# Altium schematic sheet [04] - VIDEO INPUT.SchDoc
size A2; DocumentNumber: 4; SheetNumber: 4; SheetTotal: 18
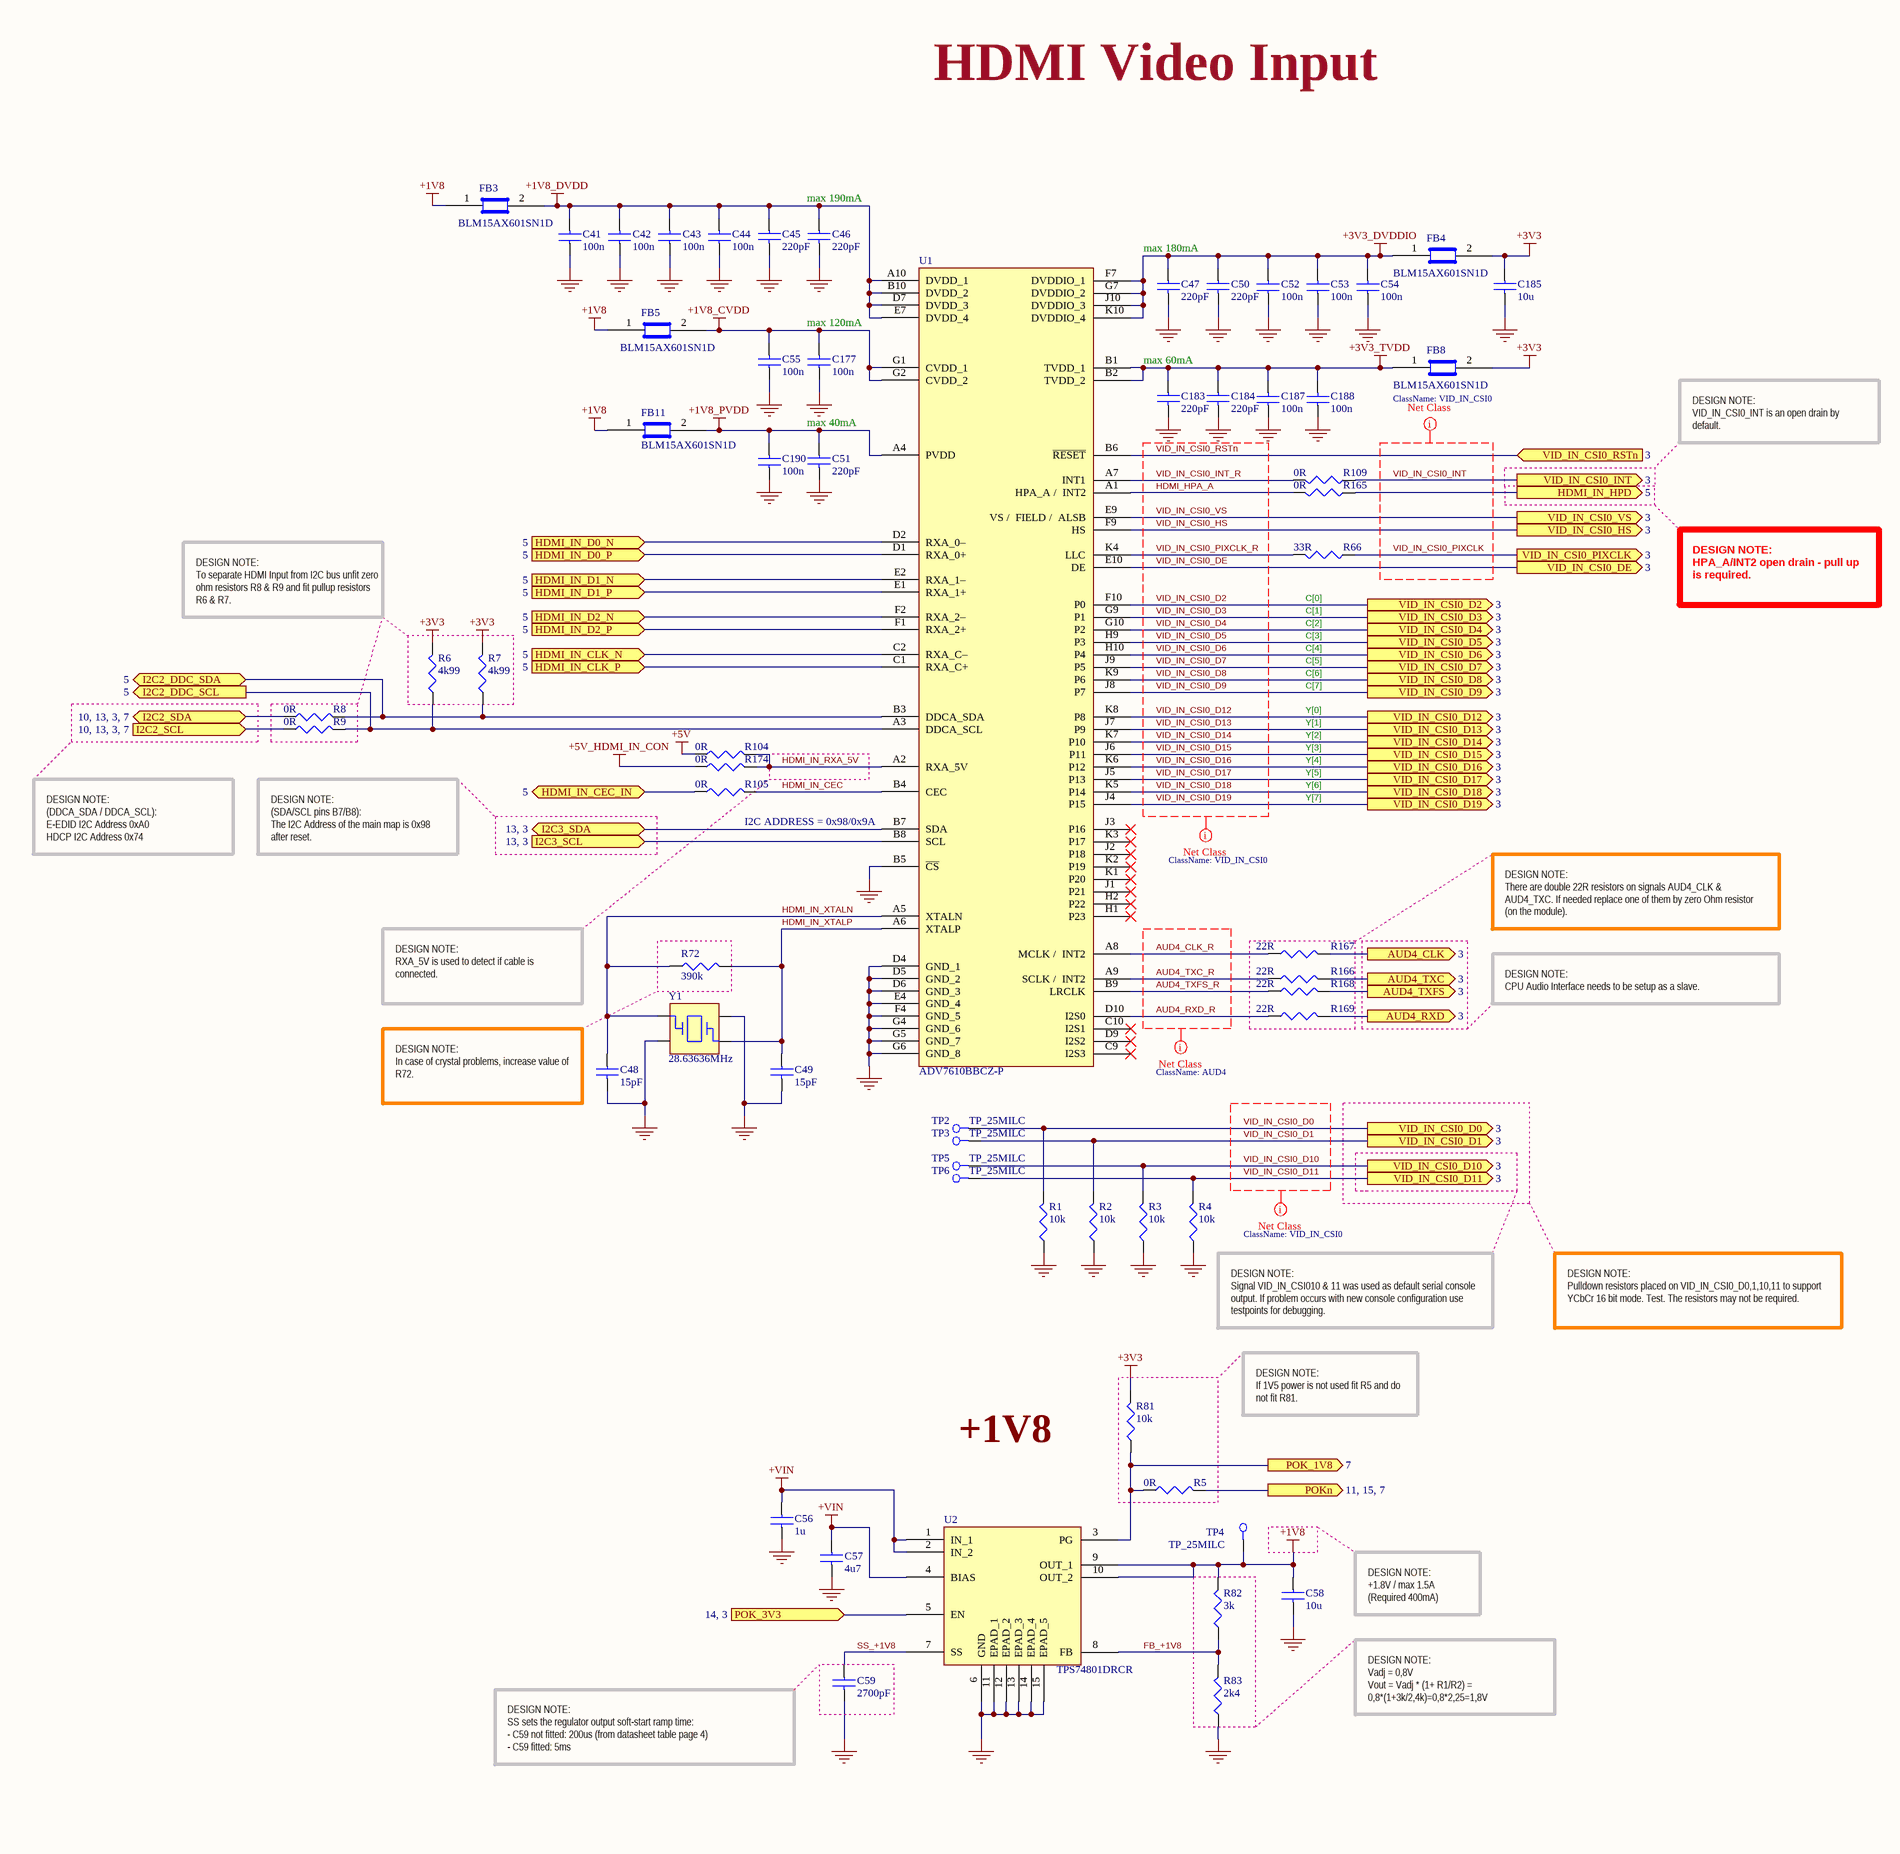
[diagram p0: [04] - VIDEO INPUT.SchDoc, left]
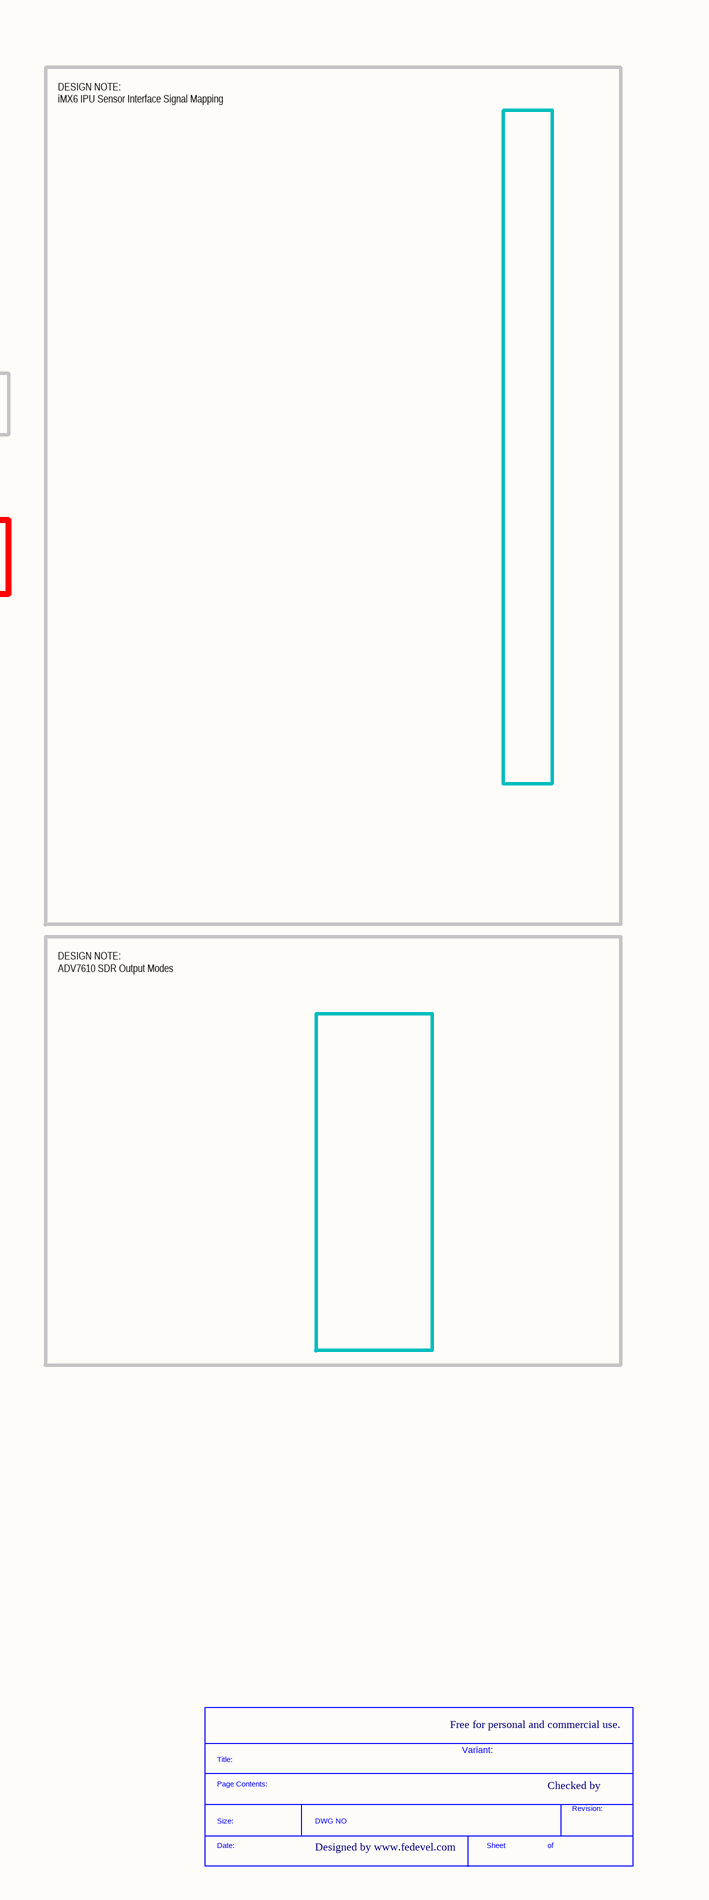
[diagram p1: [04] - VIDEO INPUT.SchDoc, right]

## Parts
*  SDTitleBlock  (value not drawn)  (graphical)
C41  100n  [C0402]
C42  100n  [C0402]
C43  100n  [C0402]
C44  100n  [C0402]
C45  220pF  [C0402]
C46  220pF  [C0402]
C47  220pF  [C0402]
C48  15pF  [C0402]
C49  15pF  [C0402]
C50  220pF  [C0402]
C51  220pF  [C0402]
C52  100n  [C0402]
C53  100n  [C0402]
C54  100n  [C0402]
C55  100n  [C0402]
C56  1u  [C0402]
C57  4u7  [C0402]
C58  10u  [C0603]
C59  2700pF  [C0402]
C177  100n  [C0402]
C183  220pF  [C0402]
C184  220pF  [C0402]
C185  10u  [C0603]
C187  100n  [C0402]
C188  100n  [C0402]
C190  100n  [C0402]
FB3  BLM15AX601SN1D  [C0402]
FB4  BLM15AX601SN1D  [C0402]
FB5  BLM15AX601SN1D  [C0402]
FB8  BLM15AX601SN1D  [C0402]
FB11  BLM15AX601SN1D  [C0402]
R1  10k  [R0402]
R2  10k  [R0402]
R3  10k  [R0402]
R4  10k  [R0402]
R5  0R  [R0402]
R6  4k99  [R0402]
R7  4k99  [R0402]
R8  0R  [R0402]
R9  0R  [R0402]
R66  33R  [R0402]
R72  390k  [R0402]
R81  10k  [R0402]
R82  3k  [R0402]
R83  2k4  [R0402]
R104  0R  [R0402]
R105  0R  [R0402]
R109  0R  [R0402]
R165  0R  [R0402]
R166  22R  [R0402]
R167  22R  [R0402]
R168  22R  [R0402]
R169  22R  [R0402]
R174  0R  [R0402]
TP2  TP_25MILC  [TP_25C]  (no BOM)
TP3  TP_25MILC  [TP_25C]  (no BOM)
TP4  TP_25MILC  [TP_25C]  (no BOM)
TP5  TP_25MILC  [TP_25C]  (no BOM)
TP6  TP_25MILC  [TP_25C]  (no BOM)
U1  ADV7610BBCZ-P  [76_CSP_BGA]
U2  TPS74801DRCR  [DRC (S-PVSON-N10)]
Y1  28.63636MHz  [ABM3B]

## Ports
AUD4_CLK (out, see 3), AUD4_RXD (out, see 3), AUD4_TXC (out, see 3), AUD4_TXFS (out, see 3), HDMI_IN_CEC_IN (bidir, see 5), HDMI_IN_CLK_N (in, see 5), HDMI_IN_CLK_P (in, see 5), HDMI_IN_D0_N (in, see 5), HDMI_IN_D0_P (in, see 5), HDMI_IN_D1_N (in, see 5), HDMI_IN_D1_P (in, see 5), HDMI_IN_D2_N (in, see 5), HDMI_IN_D2_P (in, see 5), HDMI_IN_HPD (out, see 5), I2C2_DDC_SCL (out, see 5), I2C2_DDC_SDA (bidir, see 5), I2C2_SCL (see 10, 13, 3, 7), I2C2_SDA (bidir, see 10, 13, 3, 7), I2C3_SCL (see 13, 3), I2C3_SDA (bidir, see 13, 3), POK_1V8 (out, see 7), POK_3V3 (see 14, 3), POKn (see 11, 15, 7), VID_IN_CSI0_D0 (out, see 3), VID_IN_CSI0_D1 (out, see 3), VID_IN_CSI0_D2 (out, see 3), VID_IN_CSI0_D3 (out, see 3), VID_IN_CSI0_D4 (out, see 3), VID_IN_CSI0_D5 (out, see 3), VID_IN_CSI0_D6 (out, see 3), VID_IN_CSI0_D7 (out, see 3), VID_IN_CSI0_D8 (out, see 3), VID_IN_CSI0_D9 (out, see 3), VID_IN_CSI0_D10 (out, see 3), VID_IN_CSI0_D11 (out, see 3), VID_IN_CSI0_D12 (out, see 3), VID_IN_CSI0_D13 (out, see 3), VID_IN_CSI0_D14 (out, see 3), VID_IN_CSI0_D15 (out, see 3), VID_IN_CSI0_D16 (out, see 3), VID_IN_CSI0_D17 (out, see 3), VID_IN_CSI0_D18 (out, see 3), VID_IN_CSI0_D19 (out, see 3), VID_IN_CSI0_DE (out, see 3), VID_IN_CSI0_HS (out, see 3), VID_IN_CSI0_INT (out, see 3), VID_IN_CSI0_PIXCLK (out, see 3), VID_IN_CSI0_RSTn (in, see 3), VID_IN_CSI0_VS (out, see 3)

## Nets
+1V8: C58.1 FB3.1 FB5.1 FB11.1 R82.2 TP4.1 U2.9(OUT_1) U2.10(OUT_2)
+1V8_CVDD: C55.2 C177.2 FB5.2 U1.G1(CVDD_1) U1.G2(CVDD_2)
+1V8_DVDD: C41.2 C42.2 C43.2 C44.2 C45.1 C46.1 FB3.2 U1.A10(DVDD_1) U1.B10(DVDD_2) U1.D7(DVDD_3) U1.E7(DVDD_4)
+1V8_PVDD: C51.1 C190.2 FB11.2 U1.A4(PVDD)
+3V3: C185.1 FB4.2 FB8.2 R6.2 R7.2 R81.2
+3V3_DVDDIO: C47.1 C50.1 C52.2 C53.2 C54.2 FB4.1 U1.F7(DVDDIO_1) U1.G7(DVDDIO_2) U1.J10(DVDDIO_3) U1.K10(DVDDIO_4)
+3V3_TVDD: C183.1 C184.1 C187.2 C188.2 FB8.1 U1.B1(TVDD_1) U1.B2(TVDD_2)
+5V: R104.1
+5V_HDMI_IN_CON: R174.1
+VIN: C56.1 C57.1 U2.1(IN_1) U2.2(IN_2) U2.4(BIAS)
GND: C41.1 C42.1 C43.1 C44.1 C45.2 C46.2 C47.2 C48.2 C49.2 C50.2 C51.2 C52.1 C53.1 C54.1 C55.1 C56.2 C57.2 C58.2 C59.2 C177.1 C183.2 C184.2 C185.2 C187.1 C188.1 C190.1 R1.1 R2.1 R3.1 R4.1 R83.1 U1.B5(~{CS}) U1.D4(GND_1) U1.D5(GND_2) U1.D6(GND_3) U1.E4(GND_4) U1.F4(GND_5) U1.G4(GND_6) U1.G5(GND_7) U1.G6(GND_8) U2.6(GND) U2.11(EPAD_1) U2.12(EPAD_2) U2.13(EPAD_3) U2.14(EPAD_4) U2.15(EPAD_5) Y1.2 Y1.4
AUD4_CLK: R167.2 ; port AUD4_CLK
AUD4_CLK_R: R167.1 U1.A8(MCLK_/__INT2)
AUD4_RXD: R169.2 ; port AUD4_RXD
AUD4_RXD_R: R169.1 U1.D10(I2S0)
AUD4_TXC: R166.2 ; port AUD4_TXC
AUD4_TXC_R: R166.1 U1.A9(SCLK_/__INT2)
AUD4_TXFS: R168.2 ; port AUD4_TXFS
AUD4_TXFS_R: R168.1 U1.B9(LRCLK)
FB_+1V8: R82.1 R83.2 U2.8(FB)
HDMI_HPA_A: R165.2 U1.A1(HPA_A_/__INT2)
HDMI_IN_CEC: R105.2 U1.B4(CEC)
HDMI_IN_CEC_IN: R105.1 ; port HDMI_IN_CEC_IN
HDMI_IN_CLK_N: U1.C2(RXA_C–) ; port HDMI_IN_CLK_N
HDMI_IN_CLK_P: U1.C1(RXA_C+) ; port HDMI_IN_CLK_P
HDMI_IN_D0_N: U1.D2(RXA_0–) ; port HDMI_IN_D0_N
HDMI_IN_D0_P: U1.D1(RXA_0+) ; port HDMI_IN_D0_P
HDMI_IN_D1_N: U1.E2(RXA_1–) ; port HDMI_IN_D1_N
HDMI_IN_D1_P: U1.E1(RXA_1+) ; port HDMI_IN_D1_P
HDMI_IN_D2_N: U1.F2(RXA_2–) ; port HDMI_IN_D2_N
HDMI_IN_D2_P: U1.F1(RXA_2+) ; port HDMI_IN_D2_P
HDMI_IN_HPD: R165.1 ; port HDMI_IN_HPD
HDMI_IN_RXA_5V: R104.2 R174.2 U1.A2(RXA_5V)
HDMI_IN_XTALN: C48.1 R72.1 U1.A5(XTALN) Y1.1
HDMI_IN_XTALP: C49.1 R72.2 U1.A6(XTALP) Y1.3
I2C2_DDC_SCL: R6.1 R9.2 U1.A3(DDCA_SCL) ; port I2C2_DDC_SCL
I2C2_DDC_SDA: R7.1 R8.2 U1.B3(DDCA_SDA) ; port I2C2_DDC_SDA
I2C2_SCL: R9.1 ; port I2C2_SCL
I2C2_SDA: R8.1 ; port I2C2_SDA
I2C3_SCL: U1.B8(SCL) ; port I2C3_SCL
I2C3_SDA: U1.B7(SDA) ; port I2C3_SDA
POK_1V8: R5.1 R81.1 U2.3(PG) ; port POK_1V8
POK_3V3: U2.5(EN) ; port POK_3V3
POKn: R5.2 ; port POKn
SS_+1V8: C59.1 U2.7(SS)
VID_IN_CSI0_D0: R1.2 TP2.1 ; port VID_IN_CSI0_D0
VID_IN_CSI0_D1: R2.2 TP3.1 ; port VID_IN_CSI0_D1
VID_IN_CSI0_D2: U1.F10(P0) ; port VID_IN_CSI0_D2
VID_IN_CSI0_D3: U1.G9(P1) ; port VID_IN_CSI0_D3
VID_IN_CSI0_D4: U1.G10(P2) ; port VID_IN_CSI0_D4
VID_IN_CSI0_D5: U1.H9(P3) ; port VID_IN_CSI0_D5
VID_IN_CSI0_D6: U1.H10(P4) ; port VID_IN_CSI0_D6
VID_IN_CSI0_D7: U1.J9(P5) ; port VID_IN_CSI0_D7
VID_IN_CSI0_D8: U1.K9(P6) ; port VID_IN_CSI0_D8
VID_IN_CSI0_D9: U1.J8(P7) ; port VID_IN_CSI0_D9
VID_IN_CSI0_D10: R3.2 TP5.1 ; port VID_IN_CSI0_D10
VID_IN_CSI0_D11: R4.2 TP6.1 ; port VID_IN_CSI0_D11
VID_IN_CSI0_D12: U1.K8(P8) ; port VID_IN_CSI0_D12
VID_IN_CSI0_D13: U1.J7(P9) ; port VID_IN_CSI0_D13
VID_IN_CSI0_D14: U1.K7(P10) ; port VID_IN_CSI0_D14
VID_IN_CSI0_D15: U1.J6(P11) ; port VID_IN_CSI0_D15
VID_IN_CSI0_D16: U1.K6(P12) ; port VID_IN_CSI0_D16
VID_IN_CSI0_D17: U1.J5(P13) ; port VID_IN_CSI0_D17
VID_IN_CSI0_D18: U1.K5(P14) ; port VID_IN_CSI0_D18
VID_IN_CSI0_D19: U1.J4(P15) ; port VID_IN_CSI0_D19
VID_IN_CSI0_DE: U1.E10(DE) ; port VID_IN_CSI0_DE
VID_IN_CSI0_HS: U1.F9(HS) ; port VID_IN_CSI0_HS
VID_IN_CSI0_INT: R109.1 ; port VID_IN_CSI0_INT
VID_IN_CSI0_INT_R: R109.2 U1.A7(INT1)
VID_IN_CSI0_PIXCLK: R66.1 ; port VID_IN_CSI0_PIXCLK
VID_IN_CSI0_PIXCLK_R: R66.2 U1.K4(LLC)
VID_IN_CSI0_RSTn: U1.B6(~{RESET}) ; port VID_IN_CSI0_RSTn
VID_IN_CSI0_VS: U1.E9(VS_/__FIELD_/__ALSB) ; port VID_IN_CSI0_VS

Not connected (* = marked no-connect by the designer): U1 C9(I2S3)* C10(I2S1)* D9(I2S2)* H1(P23)* H2(P22)* J1(P21)* J2(P18)* J3(P16)* K1(P20)* K2(P19)* K3(P17)*

## Layout directives
net class VID_IN_CSI0: HDMI_HPA_A, VID_IN_CSI0_D0, VID_IN_CSI0_D1, VID_IN_CSI0_D2, VID_IN_CSI0_D3, VID_IN_CSI0_D4, VID_IN_CSI0_D5, VID_IN_CSI0_D6, VID_IN_CSI0_D7, VID_IN_CSI0_D8, VID_IN_CSI0_D9, VID_IN_CSI0_D10, VID_IN_CSI0_D11, VID_IN_CSI0_D12, VID_IN_CSI0_D13, VID_IN_CSI0_D14, VID_IN_CSI0_D15, VID_IN_CSI0_D16, VID_IN_CSI0_D17, VID_IN_CSI0_D18, VID_IN_CSI0_D19, VID_IN_CSI0_DE, VID_IN_CSI0_HS, VID_IN_CSI0_INT, VID_IN_CSI0_INT_R, VID_IN_CSI0_PIXCLK, VID_IN_CSI0_PIXCLK_R, VID_IN_CSI0_RSTn, VID_IN_CSI0_VS
net class AUD4: AUD4_CLK_R, AUD4_RXD_R, AUD4_TXC_R, AUD4_TXFS_R

## Notes on the sheet
- HDMI Video Input
- DESIGN NOTE:
  iMX6 IPU Sensor Interface Signal Mapping
- (near C46) max 190mA
- max 180mA
- (near C177) max 120mA
- max 60mA
- (near C51) max 40mA
- DESIGN NOTE:
  VID_IN_CSI0_INT is an open drain by default.
- DESIGN NOTE:
  HPA_A/INT2 open drain - pull up is required.
- DESIGN NOTE:
  To separate HDMI Input from I2C bus unfit zero ohm resistors R8 & R9 and fit pullup resistors R6 & R7.
- (near R66) C[0]
- C[1]
- C[2]
- C[3]
- C[4]
- C[5]
- C[6]
- C[7]
- Y[0]
- Y[1]
- Y[2]
- Y[3]
- Y[4]
- Y[5]
- (near R105) I2C ADDRESS = 0x98/0x9A
- Y[6]
- Y[7]
- DESIGN NOTE:
  (DDCA_SDA / DDCA_SCL):
  E-EDID I2C Address 0xA0
  HDCP I2C Address 0x74
- DESIGN NOTE:
  (SDA/SCL pins B7/B8):
  The I2C Address of the main map is 0x98 after reset.
- DESIGN NOTE:
  There are double 22R resistors on signals AUD4_CLK & AUD4_TXC. If needed replace one of them by zero Ohm resistor (on the module).
- DESIGN NOTE:
  RXA_5V is used to detect if cable is connected.
- DESIGN NOTE:
  CPU Audio Interface needs to be setup as a slave.
- DESIGN NOTE:
  ADV7610 SDR Output Modes
- (near C48) DESIGN NOTE:
  In case of crystal problems, increase value of R72.
- (near R4) DESIGN NOTE:
  Signal VID_IN_CSI010 & 11 was used as default serial console output. If problem occurs with new console configuration use testpoints for debugging.
- DESIGN NOTE:
  Pulldown resistors placed on VID_IN_CSI0_D0,1,10,11 to support YCbCr 16 bit mode. Test. The resistors may not be required.
- +1V8
- DESIGN NOTE:
  If 1V5 power is not used fit R5 and do not fit R81.
- DESIGN NOTE:
  +1.8V / max 1.5A
  (Required 400mA)
- DESIGN NOTE:
  Vadj = 0,8V
  Vout = Vadj * (1+ R1/R2) = 0,8*(1+3k/2,4k)=0,8*2,25=1,8V
- DESIGN NOTE:
  SS sets the regulator output soft-start ramp time:
  - C59 not fitted: 200us (from datasheet table page 4)
  - C59 fitted: 5ms
- Free for personal and commercial use.
- Variant:
- Checked by
- Designed by www.fedevel.com
- (in symbol SDTitleBlock) Title:; Page Contents:; Revision:; Size:; DWG NO; Date:; Sheet; of

## Library data of the parts
C41-C44 C52-C55 C177 C187 C188 C190 = C1005X5R1H104K: CAP CER .10UF 50V X5R 10% 0402; Manufacturer: TDK Corporation; Capacitance: 0.1µF; Value: 100nF; .Checked PCB: used; Category: Capacitors; Supplier Part Number: 445-5942-1-ND; Manufacturer Part Number: C1005X5R1H104K; Operating Temperature: -55°C ~ 85°C; Package / Case: 0402 (1005 Metric); Price 1k [$]: 0.02340; .Checked SCH: used; Voltage - Rated: 50V; Supplier: Digikey; Supplier 1: Digi-Key; Supplier Part Number 1: 445-5942-1-ND; RoHS: RoHS Compliant; Stock 1: 106926; Pricing 1: 1=0.27, 10=0.18, 100=0.072, 250=0.05176, 500=0.0369, 1000=0.027 (USD); Tolerance: ±10%; Temperature Coefficient: X5R; Mounting Type: Surface Mount, MLCC; Applications: General Purpose; Ratings: -; Size / Dimension: 0.039" L x 0.020" W (1.00mm x 0.50mm); Height - Seated (Max): -; Thickness (Max): 0.022" (0.55mm); Lead Spacing: -; Features: -; Packaging: Cut Tape (CT); Lead Style: -; ComponentLink1URL: http://www.tdk.co.jp/tefe02/e412_c.pdf; ComponentLink1Description: http://www.tdk.co.jp/tefe02/e412_c.pdf
C45-C47 C50 C51 C183 C184 = C1005X7R1H221K: CAP CER 220PF 50V X7R 10% 0402; Manufacturer: TDK Corporation; .Checked PCB: used; Capacitance: 220pF; Category: Capacitors; Supplier Part Number: 445-1254-1-ND; Manufacturer Part Number: C1005X7R1H221K; Operating Temperature: -55°C ~ 125°C; Package / Case: 0402 (1005 Metric); Price 1k [$]: 0.00650; Value: 220pF; .Checked SCH: used; Voltage - Rated: 50V; Supplier: Digikey; Supplier 1: Digi-Key; Supplier Part Number 1: 445-1254-1-ND; RoHS: RoHS Compliant; Stock 1: 212041; Pricing 1: 1=0.08, 10=0.05, 100=0.018, 250=0.013, 500=0.0096, 1000=0.0065 (USD); Tolerance: ±10%; Temperature Coefficient: X7R; Mounting Type: Surface Mount, MLCC; Applications: General Purpose; Ratings: -; Size / Dimension: 0.039" L x 0.020" W (1.00mm x 0.50mm); Height - Seated (Max): -; Thickness (Max): 0.022" (0.55mm); Lead Spacing: -; Features: -; Packaging: Cut Tape (CT); Lead Style: -; ComponentLink1URL: http://www.tdk.co.jp/tefe02/e412_c.pdf; ComponentLink1Description: http://www.tdk.co.jp/tefe02/e412_c.pdf
C48 C49 = C1005C0G1H150J: CAP CER 15PF 50V 5% NP0 0402; Manufacturer: TDK Corporation; Temperature Coefficient: C0G, NP0; .Checked PCB: used; Supplier 1: Digi-Key; Supplier Part Number 1: 445-1237-1-ND; Manufacturer Part Number: C1005C0G1H150J; RoHS: RoHS Compliant; Category: Capacitors; Stock 1: 204632; Pricing 1: 10=0.024, 100=0.011, 250=0.009, 500=0.0077, 1000=0.006, 5000=0.005 (USD); Capacitance: 15pF; Voltage - Rated: 50V; Tolerance: ±5%; Mounting Type: Surface Mount, MLCC; Operating Temperature: -55°C ~ 125°C; Applications: General Purpose; Ratings: -; Package / Case: 0402 (1005 Metric); Size / Dimension: 0.039" L x 0.020" W (1.00mm x 0.50mm); Height - Seated (Max): -; Thickness (Max): 0.022" (0.55mm); Lead Spacing: -; Features: -; Packaging: Cut Tape (CT); Lead Style: -; ComponentLink1URL: http://www.tdk.com/pdf/general_B11.pdf; ComponentLink1Description: http://www.tdk.com/pdf/general_B11.pdf; .Checked SCH: used
C56 = C1005X5R1C105K: CAP CER 1.0UF 16V X5R 0402; Manufacturer: TDK Corporation; Capacitance: 1.0µF; Value: 1uF; .Checked PCB: used; Tolerance: ±10%; Category: Capacitors; Supplier Part Number: 445-4978-1-ND; Manufacturer Part Number: C1005X5R1C105K; Operating Temperature: -55°C ~ 85°C; Package / Case: 0402 (1005 Metric); Price 1k [$]: 0.02080; .Checked SCH: used; Voltage - Rated: 16V; Supplier: Digikey; Supplier 1: Digi-Key; Supplier Part Number 1: 445-4978-1-ND; RoHS: RoHS Compliant; Stock 1: 341010; Pricing 1: 1=0.24, 10=0.16, 100=0.064, 250=0.046, 500=0.0328, 1000=0.024 (USD); Temperature Coefficient: X5R; Mounting Type: Surface Mount, MLCC; Applications: General Purpose; Ratings: -; Size / Dimension: 0.039" L x 0.020" W (1.00mm x 0.50mm); Height - Seated (Max): -; Thickness (Max): 0.022" (0.55mm); Lead Spacing: -; Features: -; Packaging: Cut Tape (CT); Lead Style: -; ComponentLink1URL: http://www.tdk.co.jp/tefe02/e412_c.pdf; ComponentLink1Description: http://www.tdk.co.jp/tefe02/e412_c.pdf
C57 = C1005X5R1A475M: CAP CER 4.7UF 10V 20% X5R 0402; Manufacturer: TDK Corporation; Capacitance: 4.7µF; .Checked PCB: used; Supplier 1: Digi-Key; Supplier Part Number 1: 445-8023-1-ND; Manufacturer Part Number: C1005X5R1A475M; RoHS: RoHS Compliant; Category: Capacitors; Stock 1: 10140; Pricing 1: 1=0.53, 10=0.415, 100=0.25, 250=0.18752, 500=0.16, 1000=0.125, 5000=0.095 (USD); Voltage - Rated: 10V; Tolerance: ±20%; Temperature Coefficient: X5R; Mounting Type: Surface Mount, MLCC; Operating Temperature: -55°C ~ 85°C; Applications: General Purpose; Ratings: -; Package / Case: 0402 (1005 Metric); Size / Dimension: 0.039" L x 0.020" W (1.00mm x 0.50mm); Height - Seated (Max): -; Thickness (Max): -; Lead Spacing: -; Features: -; Packaging: Cut Tape (CT); Lead Style: -; ComponentLink1URL: http://www.tdk.com/pdf/general_B11.pdf; ComponentLink1Description: http://www.tdk.com/pdf/general_B11.pdf; .Checked SCH: used
C58 C185 = C1608X5R0J106M: CAP CER 10UF 6.3V X5R 20% 0603; Manufacturer: TDK Corporation; Capacitance: 10µF; Value: 10µF; .Checked PCB: used; Category: Capacitors; Supplier Part Number: 445-4112-1-ND; Manufacturer Part Number: C1608X5R0J106M; Operating Temperature: -55°C ~ 85°C; Package / Case: 0603 (1608 Metric); Price 1k [$]: 0.08580; .Checked SCH: used; Voltage - Rated: 6.3V; Features: Low ESR; Supplier: Digikey; Supplier 1: Digi-Key; Supplier Part Number 1: 445-4112-1-ND; RoHS: RoHS Compliant; Stock 1: 48157; Pricing 1: 1=0.46, 10=0.363, 100=0.1898, 250=0.14024, 500=0.1089, 1000=0.0858 (USD); Tolerance: ±20%; Temperature Coefficient: X5R; Mounting Type: Surface Mount, MLCC; Applications: General Purpose; Ratings: -; Size / Dimension: 0.063" L x 0.031" W (1.60mm x 0.80mm); Height - Seated (Max): -; Thickness (Max): 0.037" (0.95mm); Lead Spacing: -; Packaging: Cut Tape (CT); Lead Style: -; ComponentLink1URL: http://www.tdk.com/pdf/general_B11.pdf; ComponentLink1Description: http://www.tdk.com/pdf/general_B11.pdf
C59 = GRM155R71H272KA01D: CAP CER 2700PF 50V 10% X7R 0402; Manufacturer: Murata Electronics North America; .Checked PCB: used; Supplier 1: Digi-Key; Supplier Part Number 1: 490-1306-1-ND; Manufacturer Part Number: GRM155R71H272KA01D; RoHS: RoHS Compliant; Category: Capacitors; Stock 1: 38160; Pricing 1: 10=0.01, 50=0.0086, 100=0.0074, 250=0.00664, 500=0.00618, 750=0.00571, 1000=0.00542 (USD); Capacitance: 2700pF; Voltage - Rated: 50V; Tolerance: ±10%; Temperature Coefficient: X7R; Mounting Type: Surface Mount, MLCC; Operating Temperature: -55°C ~ 125°C; Applications: General Purpose; Ratings: -; Package / Case: 0402 (1005 Metric); Size / Dimension: 0.039" L x 0.020" W (1.00mm x 0.50mm); Height - Seated (Max): -; Thickness (Max): 0.022" (0.55mm); Lead Spacing: -; Features: -; Packaging: Cut Tape (CT); Lead Style: -; ComponentLink1URL: http://search.murata.co.jp/Ceramy/image/img/PDF/ENG/GRM155R71H272KA01.pdf; ComponentLink1Description: http://search.murata.co.jp/Ceramy/image/img/PDF/ENG/GRM155R71H272KA01.pdf; .Checked SCH: used
FB3-FB5 FB8 FB11 = BLM15AX601SN1D: FERRITE CHIP 600 OHM 0402 420mA; Manufacturer: Murata Electronics North America; .Checked PCB: used; Impedance @ Frequency: 600 Ohm @ 100MHz; DC Resistance (DCR): 340 mOhm Max; Filter Type: Differential Mode - Single; Number of Lines: 1; .Checked SCH: used; Category: Filters; Supplier Part Number: 490-5441-1-ND; Manufacturer Part Number: BLM15AX601SN1D; Package / Case: 0402 (1005 Metric); Price 1k [$]: 0.03280; Value: BLM15AX601SN1D; Current Rating: 420mA; Supplier: Digikey; Supplier 1: Digi-Key; Supplier Part Number 1: 490-5441-1-ND; RoHS: RoHS Compliant; Stock 1: 34008; Pricing 1: 1=0.26, 10=0.197, 50=0.1148, 100=0.0918, 250=0.0656, 500=0.0446, 1000=0.03608, 5000=0.02821 (USD); Mounting Type: Surface Mount; Packaging: Cut Tape (CT); Height (Max): 0.022" (0.55mm); Size / Dimension: 0.039" L x 0.020" W (1.00mm x 0.50mm); ComponentLink1URL: http://search.murata.co.jp/Ceramy/image/img/PDF/ENG/L0110S0100BLM15AX_SN.pdf; ComponentLink1Description: http://search.murata.co.jp/Ceramy/image/img/PDF/ENG/L0110S0100BLM15AX_SN.pdf
R1-R4 R81 = RC0402FR-0710KL: RES 10.0K OHM 1/16W 1% 0402 SMD; Manufacturer: Yageo; Power (Watts): 0.063W, 1/16W; .Checked PCB: used; Temperature Coefficient: ±100ppm/°C; Category: Resistors; Manufacturer Part Number: RC0402FR-0710KL; Package / Case: 0402 (1005 Metric); Price 1k [$]: 0.01421; Resistance (Ohms): 10K; Tolerance: ±1%; Value: 10k; .Checked SCH: used; Supplier Part Number: 311-10.0KLRCT-ND; Supplier: Digikey; Supplier 1: Digi-Key; Supplier Part Number 1: 311-10.0KLRCT-ND; RoHS: RoHS Compliant; Stock 1: 2916495; Pricing 1: 10=0.014, 50=0.0104, 100=0.0079, 250=0.00584, 500=0.00432, 1000=0.00288 (USD); Composition: Thick Film; Features: -; Size / Dimension: 0.039" L x 0.020" W (1.00mm x 0.50mm); Height: 0.016" (0.40mm); Number of Terminations: 2; Packaging: Cut Tape (CT); ComponentLink1URL: http://www.yageo.com/documents/recent/PYu-RC0402_51_RoHS_L_6.pdf; ComponentLink1Description: http://www.yageo.com/documents/recent/PYu-RC0402_51_RoHS_L_6.pdf
R5 R8 R9 R104 R105 R109 R165 R174 = RC0402JR-070RL: RES 0.0 OHM 1/16W 0402 SMD; Manufacturer: Yageo; Resistance (Ohms): 0.0; Power (Watts): 0.063W, 1/16W; Tolerance: Jumper; .Checked PCB: used; Category: Resistors; Manufacturer Part Number: RC0402JR-070RL; Package / Case: 0402 (1005 Metric); Price 1k [$]: 0.01389; Value: 0R; .Checked SCH: used; Supplier Part Number: 311-0.0JRCT-ND; Supplier: Digikey; Supplier 1: Digi-Key; Supplier Part Number 1: 311-0.0JRCT-ND; RoHS: RoHS Compliant; Stock 1: 1106330; Pricing 1: 10=0.012, 50=0.009, 100=0.0069, 250=0.00512, 500=0.0038, 1000=0.00253 (USD); Composition: Thick Film; Features: -; Temperature Coefficient: -; Size / Dimension: 0.039" L x 0.020" W (1.00mm x 0.50mm); Height: 0.016" (0.40mm); Number of Terminations: 2; Packaging: Cut Tape (CT); ComponentLink1URL: http://www.yageo.com/documents/recent/PYu-RC0402_51_RoHS_L_6.pdf; ComponentLink1Description: http://www.yageo.com/documents/recent/PYu-RC0402_51_RoHS_L_6.pdf
R6 R7 = RMCF0402FT4K99: RES TF 4.99K OHM 1% 1/16W 0402; Manufacturer: Stackpole Electronics Inc; Power (Watts): 0.063W, 1/16W; .Checked PCB: used; Temperature Coefficient: ±100ppm/°C; Category: Resistors; Supplier Part Number: RMCF0402FT4K99CT-ND; Manufacturer Part Number: RMCF0402FT4K99; Package / Case: 0402 (1005 Metric); Price 1k [$]: 0.00384; Resistance (Ohms): 4.99K; Tolerance: ±1%; Value: 4k99; .Checked SCH: used; Supplier: Digikey; Supplier 1: Digi-Key; Supplier Part Number 1: RMCF0402FT4K99CT-ND; RoHS: RoHS Compliant; Stock 1: 48509; Pricing 1: 1=0.04, 10=0.025, 50=0.0138, 100=0.0105, 250=0.0078, 500=0.00576, 1000=0.00384 (USD); Composition: Thick Film; Features: -; Size / Dimension: 0.039" L x 0.020" W (1.00mm x 0.50mm); Height: 0.016" (0.40mm); Number of Terminations: 2; Packaging: Cut Tape (CT); ComponentLink1URL: http://www.seielect.com/Catalog/SEI-RMCF.pdf; ComponentLink1Description: http://www.seielect.com/Catalog/SEI-RMCF.pdf
R66 = RMCF0402FT33R0: RES TF 33 OHM 1% 1/16W 0402; Manufacturer: Stackpole Electronics Inc; Resistance (Ohms): 33; Power (Watts): 0.063W, 1/16W; .Checked PCB: used; Temperature Coefficient: ±100ppm/°C; Category: Resistors; Supplier Part Number: RMCF0402FT33R0CT-ND; Manufacturer Part Number: RMCF0402FT33R0; Package / Case: 0402 (1005 Metric); Price 1k [$]: 0.00384; Tolerance: ±1%; Value: 33R; .Checked SCH: used; Supplier: Digikey; Supplier 1: Digi-Key; Supplier Part Number 1: RMCF0402FT33R0CT-ND; RoHS: RoHS Compliant; Stock 1: 26866; Pricing 1: 1=0.04, 10=0.025, 50=0.0138, 100=0.0105, 250=0.0078, 500=0.00576, 1000=0.00384 (USD); Composition: Thick Film; Features: -; Size / Dimension: 0.039" L x 0.020" W (1.00mm x 0.50mm); Height: 0.016" (0.40mm); Number of Terminations: 2; Packaging: Cut Tape (CT); ComponentLink1URL: http://www.seielect.com/Catalog/SEI-RMCF.pdf; ComponentLink1Description: http://www.seielect.com/Catalog/SEI-RMCF.pdf
R72 = CRCW0402390KFKED: RES 390K OHM 1/16W 1% 0402 SMD; Manufacturer: Vishay Dale; Power (Watts): 0.063W, 1/16W; Temperature Coefficient: ±100ppm/°C; .Creator: MM; .Checked SCH: used; Supplier 1: Digi-Key; Manufacturer Part Number: CRCW0402390KFKED; RoHS: RoHS Compliant; Category: Resistors; Stock 1: 288225; Pricing 1: 10=0.083, 50=0.0444, 200=0.0255, 1000=0.0174 (USD); Packaging: Cut Tape (CT); Resistance (Ohms): 390k; Tolerance: ±1%; Composition: Thick Film; Features: Automotive AEC-Q200 Qualified; Package / Case: 0402 (1005 Metric); Supplier Device Package: 0402 (1005 Metric); Size / Dimension: 0.039" L x 0.020" W (1.00mm x 0.50mm); Height: 0.016" (0.40mm); Number of Terminations: 2; ComponentLink1URL: http://www.vishay.com/docs/20035/dcrcwe3.pdf; ComponentLink1Description: http://www.vishay.com/docs/20035/dcrcwe3.pdf; Supplier Part Number 1: 541-390KLCT-ND; .Checked PCB: used
R82 = RC0402FR-073KL: RES 3K OHM 1/16W 1% 0402 SMD; Manufacturer: Yageo; Power (Watts): 0.063W, 1/16W; Temperature Coefficient: ±100ppm/°C; .Creator: MM; .Checked SCH: used; Supplier 1: Digi-Key; Manufacturer Part Number: RC0402FR-073KL; RoHS: RoHS Compliant; Category: Resistors; Stock 1: 194271; Pricing 1: 1=0.1, 10=0.014, 25=0.0104, 100=0.0063, 250=0.0054, 500=0.00382, 1000=0.0027, 2500=0.00234, 5000=0.00203 (USD); Packaging: Cut Tape (CT); Resistance (Ohms): 3k; Tolerance: ±1%; Composition: Thick Film; Features: -; Package / Case: 0402 (1005 Metric); Supplier Device Package: 0402; Size / Dimension: 0.039" L x 0.020" W (1.00mm x 0.50mm); Height: 0.016" (0.40mm); Number of Terminations: 2; ComponentLink1URL: http://www.yageo.com/documents/recent/PYu-RC0402_51_RoHS_L_6.pdf; ComponentLink1Description: http://www.yageo.com/documents/recent/PYu-RC0402_51_RoHS_L_6.pdf; Supplier Part Number 1: 311-3KLRCT-ND; .Checked PCB: used
R83 = CRCW04022K40FKED: RES 2.40K OHM 1/16W 1% 0402 SMD; Manufacturer: Vishay Dale; Resistance (Ohms): 2.4K; Power (Watts): 0.063W, 1/16W; Temperature Coefficient: ±100ppm/°C; .Checked PCB: used; Supplier 1: Digi-Key; Supplier Part Number 1: 541-2.40KLCT-ND; Manufacturer Part Number: CRCW04022K40FKED; RoHS: RoHS Compliant; Category: Resistors; Stock 1: 43967; Pricing 1: 10=0.083, 50=0.0444, 200=0.0255, 1000=0.0174 (USD); Composition: Thick Film; Features: -; Tolerance: ±1%; Package / Case: 0402 (1005 Metric); Size / Dimension: 0.039" L x 0.020" W (1.00mm x 0.50mm); Height: 0.016" (0.40mm); Number of Terminations: 2; Packaging: Cut Tape (CT); ComponentLink1URL: http://www.vishay.com/doc?20035; ComponentLink1Description: http://www.vishay.com/doc?20035; .Checked SCH: used
R166-R169 = RC0402FR-0722RL: RES 22.0 OHM 1/16W 1% 0402 SMD; Manufacturer: Yageo; Resistance (Ohms): 22; Power (Watts): 0.063W, 1/16W; .Checked PCB: used; Temperature Coefficient: ±100ppm/°C; Category: Resistors; Supplier Part Number: 311-22.0LRCT-ND; Manufacturer Part Number: RC0402FR-0722RL; Package / Case: 0402 (1005 Metric); Price 1k [$]: 0.01421; Tolerance: ±1%; Value: 22R; .Checked SCH: used; Supplier: Digikey; Supplier 1: Digi-Key; Supplier Part Number 1: 311-22.0LRCT-ND; RoHS: RoHS Compliant; Stock 1: 943800; Pricing 1: 10=0.014, 50=0.0104, 100=0.0079, 250=0.00584, 500=0.00432, 1000=0.00288 (USD); Composition: Thick Film; Features: -; Size / Dimension: 0.039" L x 0.020" W (1.00mm x 0.50mm); Height: 0.016" (0.40mm); Number of Terminations: 2; Packaging: Cut Tape (CT); ComponentLink1URL: http://www.yageo.com/documents/recent/PYu-RC0402_51_RoHS_L_6.pdf; ComponentLink1Description: http://www.yageo.com/documents/recent/PYu-RC0402_51_RoHS_L_6.pdf
TP2-TP6 = TP_25MILC: Test Point 25mil
U1 = ADV7610BBCZ-P: IC RCVR HDMI 165MHZ LP 76-CSBGA; Manufacturer: Analog Devices Inc; .Creator: MM; .Checked PCB: used; Supplier 1: Digi-Key; Manufacturer Part Number: ADV7610BBCZ-P; RoHS: RoHS Compliant; Category: Integrated Circuits (ICs); Stock 1: 47; Pricing 1: 1=14.23, 10=12.938, 100=10.9974, 250=10.02704, 500=9.38012, 1000=8.60384, 2500=8.484 (USD); Packaging: Tray; Type: HDMI, Receiver; Applications: Digital Video; Mounting Type: Surface Mount; Package / Case: 76-LFBGA, CSPBGA; Supplier Device Package: 76-CSPBGA (6x6); ComponentLink1URL: http://www.analog.com/static/imported-files/data_sheets/ADV7610.pdf; ComponentLink1Description: http://www.analog.com/static/imported-files/data_sheets/ADV7610.pdf; Supplier Part Number 1: ADV7610BBCZ-P-ND; .Checked SCH: used
U2 = TPS74801DRCR: IC REG LDO ADJ 1.5A 10SON; Manufacturer: Texas Instruments; Number of Regulators: 1; Regulator Topology: Positive Adjustable; Voltage - Input: 0.8 V ~ 5.5 V; Voltage - Output: 0.8 V ~ 3.6 V; Voltage - Dropout (Typical): 0.06V @ 1.5A; Current - Output: 1.5A (Max); Current - Limit (Min): 2A; .Creator: MM; .Checked PCB: used; Supplier 1: Digi-Key; Manufacturer Part Number: TPS74801DRCR; RoHS: RoHS Compliant; Category: Integrated Circuits (ICs); Stock 1: 11680; Pricing 1: 1=2.3, 10=2.074, 25=1.8576, 100=0.972, 250=0.954, 500=0.936, 750=0.918 (USD); Packaging: Cut Tape (CT); Operating Temperature: -40°C ~ 125°C; Mounting Type: Surface Mount; Package / Case: 10-VFDFN Exposed Pad; Supplier Device Package: 10-SON (3x3); ComponentLink1URL: http://www.ti.com/lit/ds/symlink/tps74801.pdf; ComponentLink1Description: http://www.ti.com/lit/ds/symlink/tps74801.pdf; Supplier Part Number 1: 296-21563-1-ND; .Checked SCH: used
Y1 = ABM3B-28.63636MHZ-10-1-U-T: CRYSTAL 28.63636MHZ 10PF SMD; Manufacturer: Abracon Corporation; Frequency Stability: ±10ppm; ESR (Equivalent Series Resistance): 50 Ohm; Operating Mode: Fundamental; .Creator: MM; .Checked PCB: MM, paper model not checked; Supplier 1: Digi-Key; Manufacturer Part Number: ABM3B-28.63636MHZ-10-1-U-T; RoHS: RoHS Compliant; Category: Crystals and Oscillators; Stock 1: 889; Pricing 1: 1=1.09, 10=0.968, 50=0.904, 100=0.8, 500=0.756 (USD); Packaging: Cut Tape (CT); Type: MHz Crystal; Frequency: 28.63636MHz; Frequency Tolerance: ±10ppm; Load Capacitance: 10pF; Operating Temperature: -10°C ~ 60°C; Ratings: -; Mounting Type: Surface Mount; Package / Case: 4-SMD, No Lead (DFN, LCC); Size / Dimension: 0.197" L x 0.126" W (5.00mm x 3.20mm); Height: 0.043" (1.10mm); ComponentLink1URL: http://www.abracon.com/Resonators/abm3b.pdf; ComponentLink1Description: http://www.abracon.com/Resonators/abm3b.pdf; Supplier Part Number 1: 300-8220-1-ND; .Checked SCH: MM